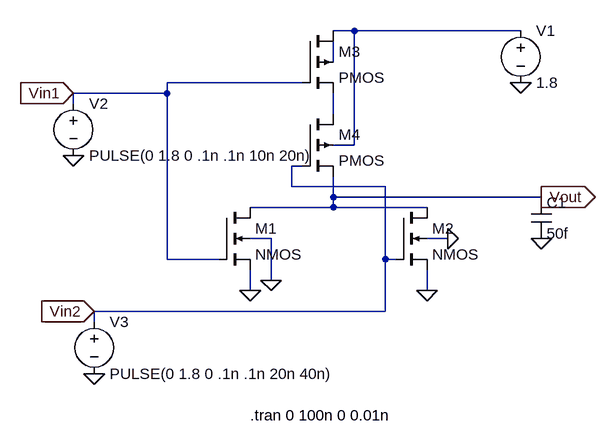
[diagram p0: schematic NOR.asc]
NOR.asc, the LTspice schematic file:
Version 4
SHEET 1 880 680
WIRE 288 -112 256 -112
WIRE 544 -112 288 -112
WIRE 256 -64 256 -96
WIRE 208 -32 0 -32
WIRE 0 -16 0 -32
WIRE 0 -16 -144 -16
WIRE -144 0 -144 -16
WIRE 256 16 256 -16
WIRE 288 64 288 -112
WIRE 288 64 256 64
WIRE 208 96 192 96
WIRE 192 128 192 96
WIRE 336 128 192 128
WIRE 256 144 256 112
WIRE 576 144 256 144
WIRE 256 160 256 144
WIRE 256 160 128 160
WIRE 400 160 256 160
WIRE 160 208 128 208
WIRE 432 208 400 208
WIRE 0 240 0 -16
WIRE 80 240 0 240
WIRE 336 240 336 128
WIRE 352 240 336 240
WIRE 160 272 160 208
WIRE 128 288 128 256
WIRE 400 288 400 256
WIRE 336 320 336 240
WIRE 336 320 -112 320
WIRE -112 336 -112 320
FLAG 400 288 0
FLAG 128 288 0
FLAG 576 208 0
FLAG 544 -32 0
FLAG -144 80 0
FLAG -112 416 0
FLAG 576 144 Vout
IOPIN 576 144 Out
FLAG -144 -16 Vin1
IOPIN -144 -16 In
FLAG -112 320 Vin2
IOPIN -112 320 In
FLAG 432 208 0
FLAG 160 272 0
SYMBOL nmos4 80 160 R0
SYMATTR InstName M1
SYMATTR Value2 l=180nm w=270nm
SYMBOL nmos4 352 160 R0
SYMATTR InstName M2
SYMATTR Value2 l=180nm w=270nm
SYMBOL pmos4 208 -112 R0
SYMATTR InstName M3
SYMATTR Value2 l=180nm w=810nm
SYMBOL pmos4 208 16 R0
SYMATTR InstName M4
SYMATTR Value2 l=180nm w=810nm
SYMBOL voltage 544 -128 R0
WINDOW 123 0 0 Left 0
WINDOW 39 0 0 Left 0
SYMATTR InstName V1
SYMATTR Value 1.8
SYMBOL voltage -144 -16 R0
WINDOW 123 0 0 Left 0
WINDOW 39 0 0 Left 0
SYMATTR InstName V2
SYMATTR Value PULSE(0 1.8 0 .1n .1n 10n 20n)
SYMBOL cap 560 144 R0
SYMATTR InstName C1
SYMATTR Value 50f
SYMBOL voltage -112 320 R0
WINDOW 123 0 0 Left 0
WINDOW 39 0 0 Left 0
SYMATTR InstName V3
SYMATTR Value PULSE(0 1.8 0 .1n .1n 20n 40n)
TEXT 128 480 Left 2 !.tran 0 100n 0 0.01n

The netlist it stands for:
* NOR.asc
M1 Vout Vin1 0 0 NMOS l=180nm w=270nm
M2 Vout Vin2 0 0 NMOS l=180nm w=270nm
M3 N001 Vin1 N003 N002 PMOS l=180nm w=810nm
M4 N003 Vin2 Vout N001 PMOS l=180nm w=810nm
V1 N001 0 1.8
V2 Vin1 0 PULSE(0 1.8 0 .1n .1n 10n 20n)
C1 Vout 0 50f
V3 Vin2 0 PULSE(0 1.8 0 .1n .1n 20n 40n)
.model NMOS NMOS
.model PMOS PMOS
.lib standard.mos
.tran 0 100n 0 0.01n
.backanno
.end